# EAGLE design power (EAGLE 7.5.0)
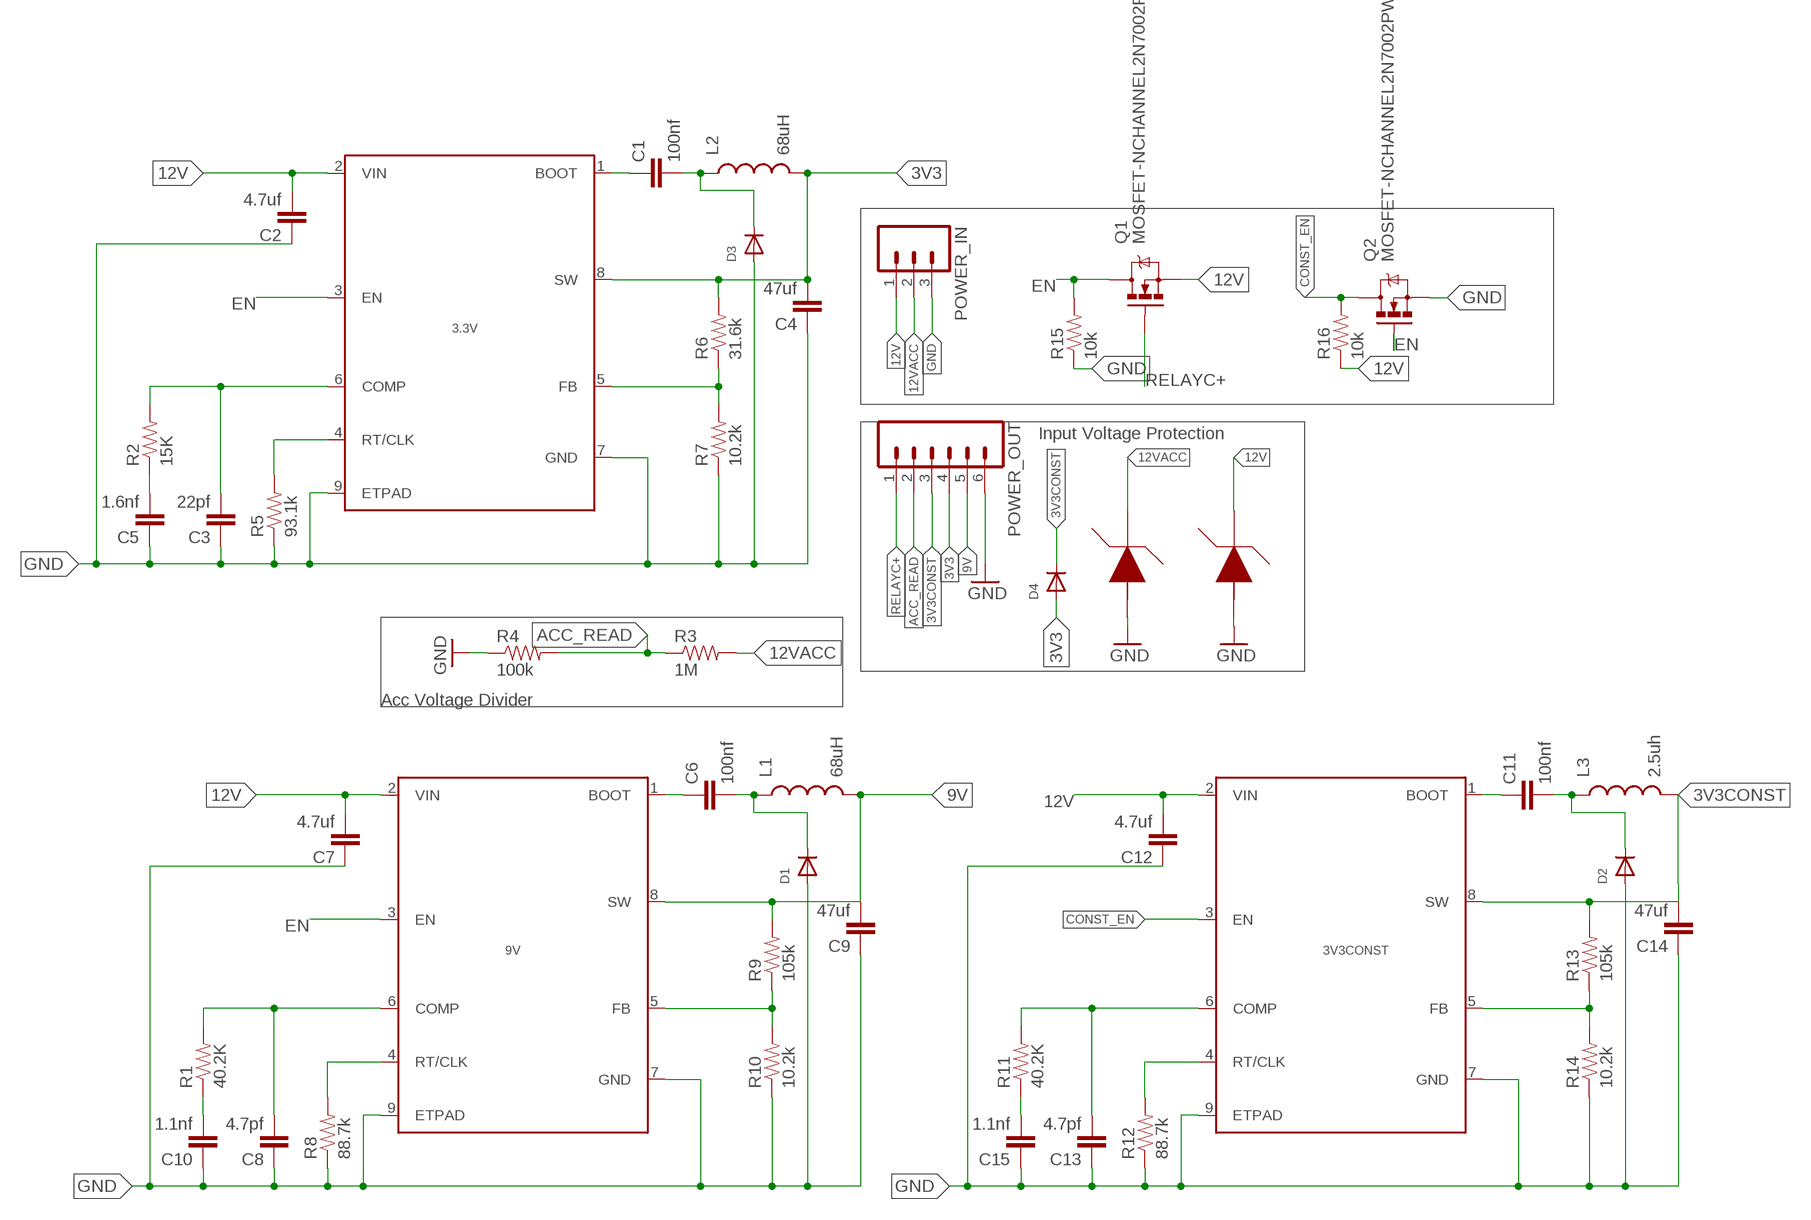
[diagram p0: schematic, sheet 1]

## Parts
3.3V  TPS54340POWERPAD  [DDA(R-PDSO-G08)]
3V3CONST  TPS54340POWERPAD  [DDA(R-PDSO-G08)]
9V  TPS54340POWERPAD  [DDA(R-PDSO-G08)]
C1  100nf  0.22UF-25V-10%(0603)  [0603-CAP]
C2  4.7uf  0.22UF-25V-10%(0603)  [0603-CAP]
C3  22pf  0.22UF-25V-10%(0603)  [0603-CAP]
C4  47uf  0.22UF-25V-10%(0603)  [0603-CAP]
C5  1.6nf  0.22UF-25V-10%(0603)  [0603-CAP]
C6  100nf  0.22UF-25V-10%(0603)  [0603-CAP]
C7  4.7uf  0.22UF-25V-10%(0603)  [0603-CAP]
C8  4.7pf  0.22UF-25V-10%(0603)  [0603-CAP]
C9  47uf  0.22UF-25V-10%(0603)  [0603-CAP]
C10  1.1nf  0.22UF-25V-10%(0603)  [0603-CAP]
C11  100nf  0.22UF-25V-10%(0603)  [0603-CAP]
C12  4.7uf  0.22UF-25V-10%(0603)  [0603-CAP]
C13  4.7pf  0.22UF-25V-10%(0603)  [0603-CAP]
C14  47uf  0.22UF-25V-10%(0603)  [0603-CAP]
C15  1.1nf  0.22UF-25V-10%(0603)  [0603-CAP]
D1  DIODESOD-323F  [SOD-323F]
D2  DIODESOD-323F  [SOD-323F]
D3  DIODESOD-323F  [SOD-323F]
D4  DIODESOD-523  [SOD-523]
L1  68uH  INDUCTOR68UH-1A  [CR75]
L2  68uH  INDUCTOR68UH-1A  [CR75]
L3  2.5uh  INDUCTORCR54-3.3UH  [CR54]
POWER_IN  M03  [03P]
POWER_OUT  M06  [06P]
Q1  MOSFET-NCHANNEL2N7002PW  [SOT323]
Q2  MOSFET-NCHANNEL2N7002PW  [SOT323]
R1  40.2K  RESISTOR0603  [0603-RES]
R2  15K  RESISTOR0603  [0603-RES]
R3  1M  RESISTOR0603  [0603-RES]
R4  100k  RESISTOR0603  [0603-RES]
R5  93.1k  RESISTOR0603  [0603-RES]
R6  31.6k  RESISTOR0603  [0603-RES]
R7  10.2k  RESISTOR0603  [0603-RES]
R8  88.7k  RESISTOR0603  [0603-RES]
R9  105k  RESISTOR0603  [0603-RES]
R10  10.2k  RESISTOR0603  [0603-RES]
R11  40.2K  RESISTOR0603  [0603-RES]
R12  88.7k  RESISTOR0603  [0603-RES]
R13  105k  RESISTOR0603  [0603-RES]
R14  10.2k  RESISTOR0603  [0603-RES]
R15  10k  RESISTOR0603  [0603-RES]
R16  10k  RESISTOR0603  [0603-RES]
U$3  SMCJ12A  [DO-214AC]
U$5  SMCJ12A  [DO-214AC]

## Nets
3V3: 3.3V.8(SW) C4.2 D4.A L2.P$2 POWER_OUT.4 R6.2
3V3CONST: 3V3CONST.8(SW) C14.2 D4.K(C) L3.P$2 POWER_OUT.3 R13.2
9V: 9V.8(SW) C9.2 L1.P$2 POWER_OUT.5 R9.2
12V: 3.3V.2(VIN) 3V3CONST.2(VIN) 9V.2(VIN) C2.2 C7.2 C12.2 POWER_IN.1 Q1.2(S) R16.1 U$5.NEG(GND)
12VACC: POWER_IN.2 R3.2 U$3.NEG(GND)
ACC_READ: POWER_OUT.2 R3.1 R4.2
CONST_EN: 3V3CONST.3(EN) Q2.3(D) R16.2
EN: 3.3V.3(EN) 9V.3(EN) Q1.3(D) Q2.1(G) R15.2
GND: 3.3V.7(GND) 3.3V.9(ETPAD) 3V3CONST.7(GND) 3V3CONST.9(ETPAD) 9V.7(GND) 9V.9(ETPAD) C2.1 C3.1 C4.1 C5.1 C7.1 C8.1 C9.1 C10.1 C12.1 C13.1 C14.1 C15.1 D1.A D2.A D3.A POWER_IN.3 POWER_OUT.6 Q2.2(S) R4.1 R5.1 R7.1 R8.1 R10.1 R12.1 R14.1 R15.1 U$3.POS(VIN) U$5.POS(VIN)
N$1: C10.2 R1.1
N$2: C5.2 R2.1
N$3: 3.3V.6(COMP) C3.2 R2.2
N$4: 3.3V.4(RT/CLK) R5.2
N$5: C1.2 D3.C L2.P$1
N$6: 3.3V.5(FB) R6.1 R7.2
N$7: 9V.6(COMP) C8.2 R1.2
N$9: 3.3V.1(BOOT) C1.1
N$10: 9V.4(RT/CLK) R8.2
N$11: 9V.5(FB) R9.1 R10.2
N$13: 9V.1(BOOT) C6.1
N$14: C6.2 D1.C L1.P$1
N$15: C15.2 R11.1
N$16: 3V3CONST.6(COMP) C13.2 R11.2
N$17: 3V3CONST.4(RT/CLK) R12.2
N$18: 3V3CONST.5(FB) R13.1 R14.2
N$20: 3V3CONST.1(BOOT) C11.1
N$21: C11.2 D2.C L3.P$1
RELAYC+: POWER_OUT.1 Q1.1(G)

## Notes on the sheet
- Input Voltage Protection
- Acc Voltage Divider

## Library data of the parts
3.3V 3V3CONST 9V = texas:TPS54340
C1-C15 = john:0.22UF-25V-10%(0603): CAP-07822; PROD_ID: CAP-07822; VALUE: 0.22uF
D1-D4 = adafruit:DIODE: Diode SMADIODE - SMA Surface Mount Package 20V 1A Schottky Diode Digikey: 641-1014-6-ND DO-1N4148 - Through Hole Small Current Diode SOD-123 20V 1 A (.5mV Vf) Schottky Diode - Digikey: MBRX120TPMSCT-ND SOD-323 10V 570mA (.38mV Vf, 3ns) Schottky Diode - Digikey: ZLLS410CT-ND SOD-523 30V 30mA Schottky Diode (RB751S-40TE61) - Digikey: RB751S-40TE61CT-ND SOT23-R/W - SOT23 Package (R = Solder Paste/Reflow Ovens, W = Hand-Soldering) BAT54Film 40V 300mA - Digikey: 497-7162-1-ND
L1 L2 = SparkFun-Passives:INDUCTOR: Inductors Basic Inductor/Choke - 0603 and 1206. Footprints are not proven and vary greatly between part numbers. INDUCTOR POWER 3.3UH 4.0A SMD 0.197" L x 0.197" W x 0.177" H (5.00mm x 5.00mm x 4.50mm); PROD_ID: NDUC-09739
L3 = john:INDUCTOR: Inductors Basic Inductor/Choke - 0603 and 1206. Footprints are not proven and vary greatly between part numbers. INDUCTOR POWER 3.3UH 4.0A SMD 0.197" L x 0.197" W x 0.177" H (5.00mm x 5.00mm x 4.50mm); PROD_ID: NDUC-11157
POWER_IN = con-amp-quick:M03: AMP QUICK CONNECTOR; OC_FARNELL: unknown; OC_NEWARK: unknown
POWER_OUT = con-amp-quick:M06: AMP QUICK CONNECTOR; OC_FARNELL: unknown; OC_NEWARK: unknown
Q1 Q2 = SparkFun-DiscreteSemi:MOSFET-NCHANNEL: Common NMOSFET Parts MFG P/N Store ID Prod ID FDD8780 TRANS-09984 SI7820DN TRANS-11055 FDS6630A IC-08089 2N7002PW TRANS-11151 FQP30N06L COM-10213 TRANS-10060 BSS123LT1G TRANS-08345 BSS138 TRANS-00830 BS170 2N7000; PROD_ID: TRANS-11151
R1-R16 = john:RESISTOR: Resistor Basic schematic elements and footprints for 0603, 1206, and PTH resistors.
U$3 U$5 = john:SMCJ12A

## Board
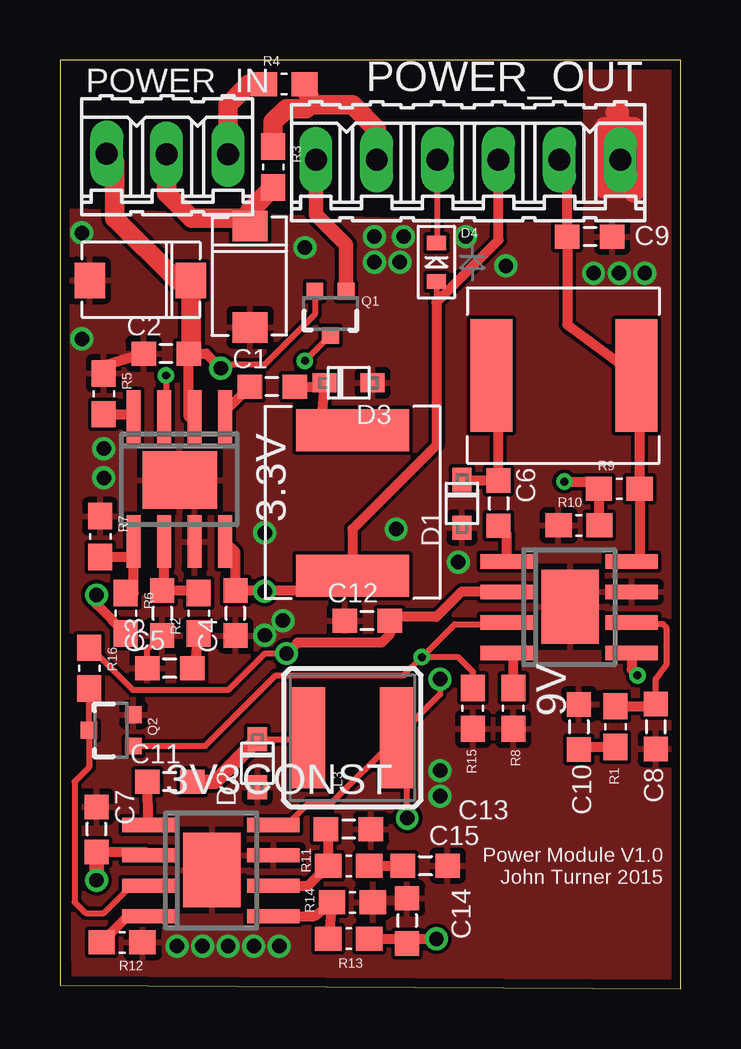
[diagram p1: board, top side]
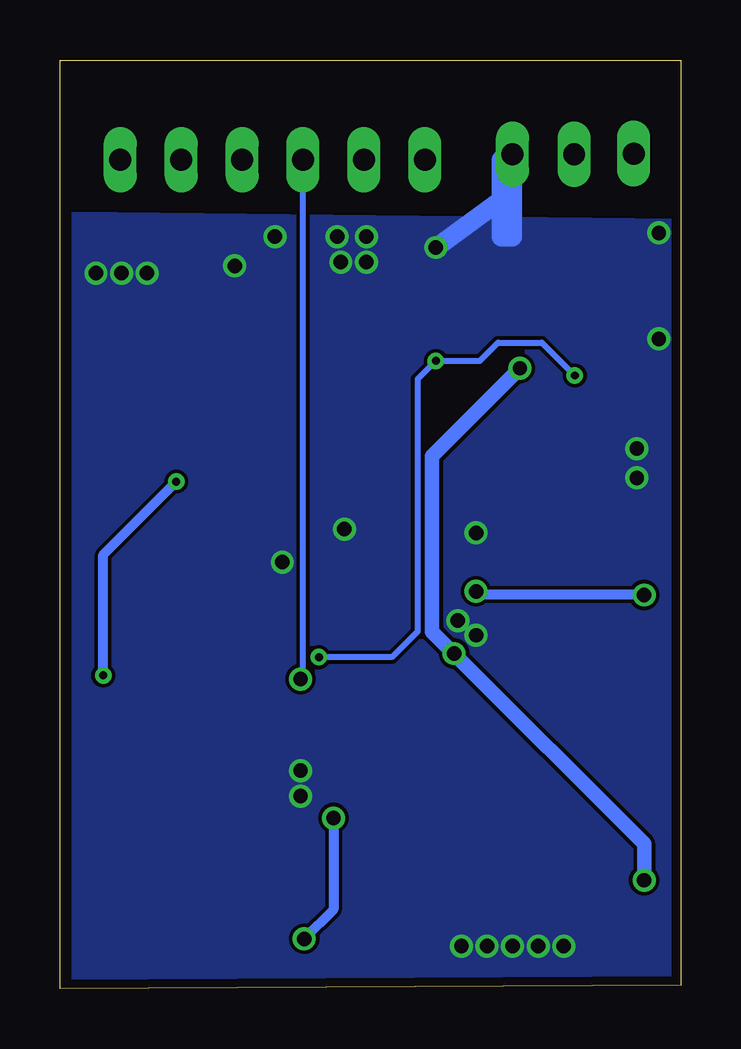
[diagram p2: board, bottom side, seen from below]

Size 25.88 x 38.7 mm. Coordinates in mm from the lower left corner, seen from the top.
Outline: 0,0.15 25.88,0 25.88,38.7 0,38.7 0,0.15
Copper layers (1*16): Top 0.0356mm / dielectric 1.5011mm / Bottom 0.0356mm
Design rules "LaenPCBOrder": minimum track width 6mil, minimum drill 13mil, track to track 6mil, track to pad 6mil, pad to pad 6mil, via to via 6mil, smd to smd 6mil, copper to edge 15mil, drill to drill 6mil, minimum pad ring 7mil, minimum via ring 7mil, stop-mask expansion 3mil, vias tented up to drill 0mil, thermal gap 10mil

### Footprints (pad centres in the part's own frame; a part is rotated, then mirrored left to right if it is on the bottom)
DDA(R-PDSO-G08) = smd 0.6 x 2.2: 1 -0.635,-5.14; 2 0.635,-5.14; 3 1.905,-5.14; 4 3.175,-5.14; 5 3.175,0.06; 6 1.905,0.06; 7 0.635,0.06; 8 -0.635,0.06 | smd 3.1 x 2.4: 9 1.25,-2.5
0603-CAP = smd 1.016 x 1: 1 -0.926,0 | smd 1.024 x 1: 2 0.952,0
SOD-323F = smd 1 x 0.8: A -1,0; C 1,0
SOD-523 = smd 0.8 x 0.6: A 0,-0.8; K 0,0.8
CR75 = smd 1.75 x 4.7: P$1 0,0; P$2 6.05,0
CR54 = smd 4.2 x 1.4: P$1 0,1.85; P$2 0,-1.85
03P = drill 0.914 long: 1 -2.515,0.254; 2 -0.025,0.229; 3 2.54,0.229
06P = drill 0.914 long: 1 -6.35,0.254; 2 -3.81,0.254; 3 -1.27,0.254; 4 1.27,0.254; 5 3.81,0.254; 6 6.35,0.254
SOT323 = smd 0.7 x 0.7: 1 -0.65,-0.925; 2 0.65,-0.925; 3 0,0.925
0603-RES = smd 1.1 x 1: 1 -0.85,0; 2 0.85,0
DO-214AC = smd 1.27 x 1.47: NEG 4.855,0; POS 0.635,0

### Placement (x,y rotation side)
3.3V  6.25,18.69 180 top
3V3CONST  8.84,6.2 270 top
9V  23.77,17.17 270 top
C1  8.84,25.1 0 top
C2  4.42,26.47 0 top
C3  4.27,15.65 90 top
C4  7.32,15.65 90 top
C5  4.57,13.36 0 top
C6  18.29,20.22 90 top
C7  1.52,6.65 270 top
C8  24.84,10.92 90 top
C9  22.1,31.34 180 top
C10  21.64,10.92 270 top
C11  4.57,8.64 0 top
C12  12.8,15.34 0 top
C13  12.04,6.65 180 top
C14  14.48,2.84 270 top
C15  15.24,5.13 180 top
D1  16.76,20.22 90 top
D2  8.23,9.4 90 top
D3  12.04,25.25 180 top
D4  15.7,30.28 0 top
L1  17.98,25.55 0 top
L2  12.19,23.27 270 top
L3  12.19,10.46 90 top
POWER_IN  4.47,34.54 0 top
POWER_OUT  17.02,34.29 0 top
Q1  11.28,28.14 180 top
Q2  2.13,10.77 90 top
R1  23.16,10.92 90 top
R2  5.79,15.65 90 top
R3  8.89,34.24 270 top
R4  9.35,37.69 0 top
R5  1.83,24.79 270 top
R6  2.74,15.65 270 top
R7  1.68,18.85 270 top
R8  18.9,11.68 90 top
R9  23.32,20.83 0 top
R10  21.64,19.3 0 top
R11  12.04,5.13 180 top
R12  2.59,1.93 180 top
R13  12.04,2.08 0 top
R14  12.19,3.61 180 top
R15  17.22,11.68 90 top
R16  1.22,13.36 270 top
U$3  7.92,26.92 90 top
U$5  0.61,29.51 0 top

### Tracks (layer width: path | path; a pad name or v marks a point on that pad's centre or on a via)
3V3  (via drill 0.6)
  Top 0.254: D4.A 15.7,28.6
  Top 0.406: 8.5,16.6 C4.2 7.32,18.2 3.3V.8 | 8.5,16.6 v8.53,16.56 | v1.52,16.41 1.52,16.02 R6.2 | POWER_OUT.4 18.29,31.19 15.7,28.6 15.7,22.66 12.19,19.15 L2.P$2 10.66,16.6 8.5,16.6
  Bottom 0.406: v1.52,16.41 8.23,16.41 v8.53,16.56
3V3CONST  (via drill 0.6)
  Top 0.254: v14.48,7.11 14.48,10.03 L3.P$2 | 3V3CONST.8 9.47,6.83 10.36,7.72 11.3,7.72 L3.P$2 | D4.K 15.75,31.13 POWER_OUT.3 | v15.85,12.9 15.85,12.27 L3.P$2
  Top 0.406: R13.2 14.14,2.08 | 14.14,2.08 C14.2 | 14.14,2.08 v15.7,2.08
  Bottom 0.254: v15.85,12.9 15.75,13 POWER_OUT.3
  Bottom 0.406: v14.48,7.11 14.48,3.3 v15.7,2.08
  Bottom 0.813: 15.7,34.49 POWER_OUT.3
9V
  Top 0.406: 24.69,25.55 L1.P$2 | L1.P$2 21.15,27.68 C9.2 21.15,34.23 POWER_OUT.5 | L1.P$2 24.17,25.42 R9.2 24.17,17.83 9V.8
12V  (via drill 0.6)
  Top 0.254: R16.1 1.28,14.21 3.05,12.45 7.01,12.45 8.53,13.97 v9.45,13.97 | Q1.2 10.63,28.1 8.53,26.01 6.86,26.01 v6.71,25.86
  Top 0.406: 3.3V.2 5.37,23.83 C2.2 6.1,26.47 v6.71,25.86 | C7.2 3.56,5.7 3V3CONST.2 | 9V.2 18.61,16.56 16.76,16.56 15.7,15.49 13.91,15.49 C12.2 13.75,14.77 13.41,14.43 9.91,14.43 v9.45,13.97
  Top 0.61: C7.2 v1.52,4.52 | v6.71,25.86 6.55,26.01 | 9.6,14.12 v9.45,13.97
  Top 0.813: POWER_IN.1 2.29,34.47 2.29,32.11 4.85,29.54 U$5.NEG 5.46,26.56 arc-90 C2.2
  Bottom 0.254: 10.36,14.88 10.52,15.04 10.52,16.71
  Bottom 0.61: v6.71,25.86 10.36,22.2 10.36,14.88 v9.45,13.97 1.52,6.05 v1.52,4.52
12VACC
  Top 0.813: POWER_IN.2 4.44,33.15 5.49,32.11 7.6,32.11 arc-90 U$3.NEG | 7.69,31.75 7.66,31.78 U$3.NEG | R3.2 7.92,32.42 U$3.NEG
ACC_READ
  Top 0.813: POWER_OUT.2 13.21,35.81 12.19,36.83 10.52,36.83 | 10.52,36.83 10.41,36.83 10.26,36.68 9.45,36.68 8.89,36.12 R3.1 | R4.2 10.5,36.84 10.52,36.83
CONST_EN
  Top 0.254: R16.2 1.21,12.5 Q2.3 1.21,9.24 0.61,8.64 0.61,3.61 1.07,3.15 1.83,3.15 2.9,4.22 3.62,4.22 3V3CONST.3
EN  (via drill 0.33)
  Top 0.254: Q1.3 v10.21,26.16 | v4.42,25.55 4.42,23.91 3.3V.3 | Q2.1 6.06,10.12 8.99,13.06 14.33,13.06 v15.09,13.82 | v15.09,13.82 16.46,15.19 19.2,15.19 19.13,15.27 9V.3 | R15.2 17.22,13.21 16.61,13.82 v15.09,13.82
  Top 0.406: 18.86,15.19 9V.3
  Bottom 0.254: v4.42,25.55 5.79,26.92 7.62,26.92 8.38,26.16 v10.21,26.16 10.97,25.4 10.97,14.88 12.04,13.82 v15.09,13.82
GND  (via drill 0.6)
  Top 0.254: C5.1 3.65,14.1 C3.1
  Top 0.406: C2.1 1.98,26.01 1.98,25.4
  Top 0.813: POWER_IN.3 7.01,36.83 7.87,37.69 R4.1 | 23.16,36.53 23.32,36.53 23.32,34.54 22.71,34.54 | 22.71,34.54 22.71,35.92 | 22.71,34.54 22.71,33.32 23.93,33.32 | 23.93,33.32 23.93,33.17 | 23.93,33.32 23.93,35.92 23.16,35.92 23.16,33.93
  Bottom 0.813: POWER_IN.3 7.01,33.32 7.47,32.87 | 7.47,32.87 v10.21,30.89 | 7.47,34.54 7.47,32.87 | 7.16,34.7 7.01,34.7 7.01,31.34 7.47,31.34 7.47,32.41
  other vias: 15.85,8.03 15.85,9.09 14.33,31.34 0.91,27.08 0.91,31.5 13.11,31.34 16.92,31.34 13.11,30.28 14.17,30.28 24.38,29.82 23.32,29.82 18.59,30.12 22.25,29.82 4.88,1.78 5.94,1.78 7.01,1.78 8.08,1.78 9.14,1.78 1.83,21.29 1.83,22.5 8.53,19 14.02,19.15 16.61,17.78 9.3,15.34 8.53,14.73
  pour Bottom: 0.15,31.95 25.3,32.26 25.3,-0.05 0.46,-0.05
  pour Top: 0.46,32.41 21.95,31.8 21.95,38.51 25.45,38.51 25.6,-0.97 0.61,-0.97
N$1
  Top 0.406: R1.1 21.74,10.07 C10.2
N$2
  Top 0.406: C5.2 5.64,13.4 R2.1
N$3
  Top 0.406: 3.3V.6 4.34,16.6 C3.2 5.64,16.6 R2.2
N$4
  Top 0.406: R5.2 3.07,23.94 3.3V.4
N$5
  Top 0.406: C1.2 10.73,25.1 D3.C 10.89,23.66 L2.P$1
N$6
  Top 0.406: R6.1 3.07,16.5 3.3V.5 3.07,18 R7.2
N$7
  Top 0.254: C8.2 24.84,12.9 25.3,13.51 25.3,15.04 25.15,15.19 23.91,15.19 9V.6
  Top 0.406: R1.2 24.74,11.77 C8.2
N$9
  Top 0.406: 3.3V.1 6.88,24.07 C1.1
N$10
  Top 0.406: R8.2 18.9,13.95 9V.4
N$11  (via drill 0.33)
  Top 0.406: R10.2 22.49,21.11 R9.1 22.16,21.13 v21.03,21.13 | 9V.5 23.83,13.3 v24.08,13.06
  Bottom 0.406: v24.08,13.06 24.08,18.08 v21.03,21.13
N$13
  Top 0.406: 9V.1 18.63,18.95 C6.1
N$14
  Top 0.406: L1.P$1 18.29,25.25 C6.2 16.81,21.17 D1.C
N$15
  Top 0.406: R11.1 C15.2
N$16
  Top 0.406: 3V3CONST.6 10.35,4.29 R11.2 11.19,6.55 C13.2
N$17
  Top 0.406: R12.2 2.83,3.02 3V3CONST.4
N$18
  Top 0.406: 3V3CONST.5 10.61,3.02 R14.2 R13.1
N$20
  Top 0.406: C11.1 3.66,6.87 3V3CONST.1
N$21
  Top 0.254: D2.C 10.28,10.4 L3.P$1
  Top 0.61: C11.2 6.47,8.64 D2.C
RELAYC+
  Top 0.61: Q1.1 11.93,31 10.67,32.26 POWER_OUT.1

### Text on the board
tNames: Power Module V1.0 / John Turner 2015